# EAGLE design HuckyV2 (EAGLE 7.1.0)
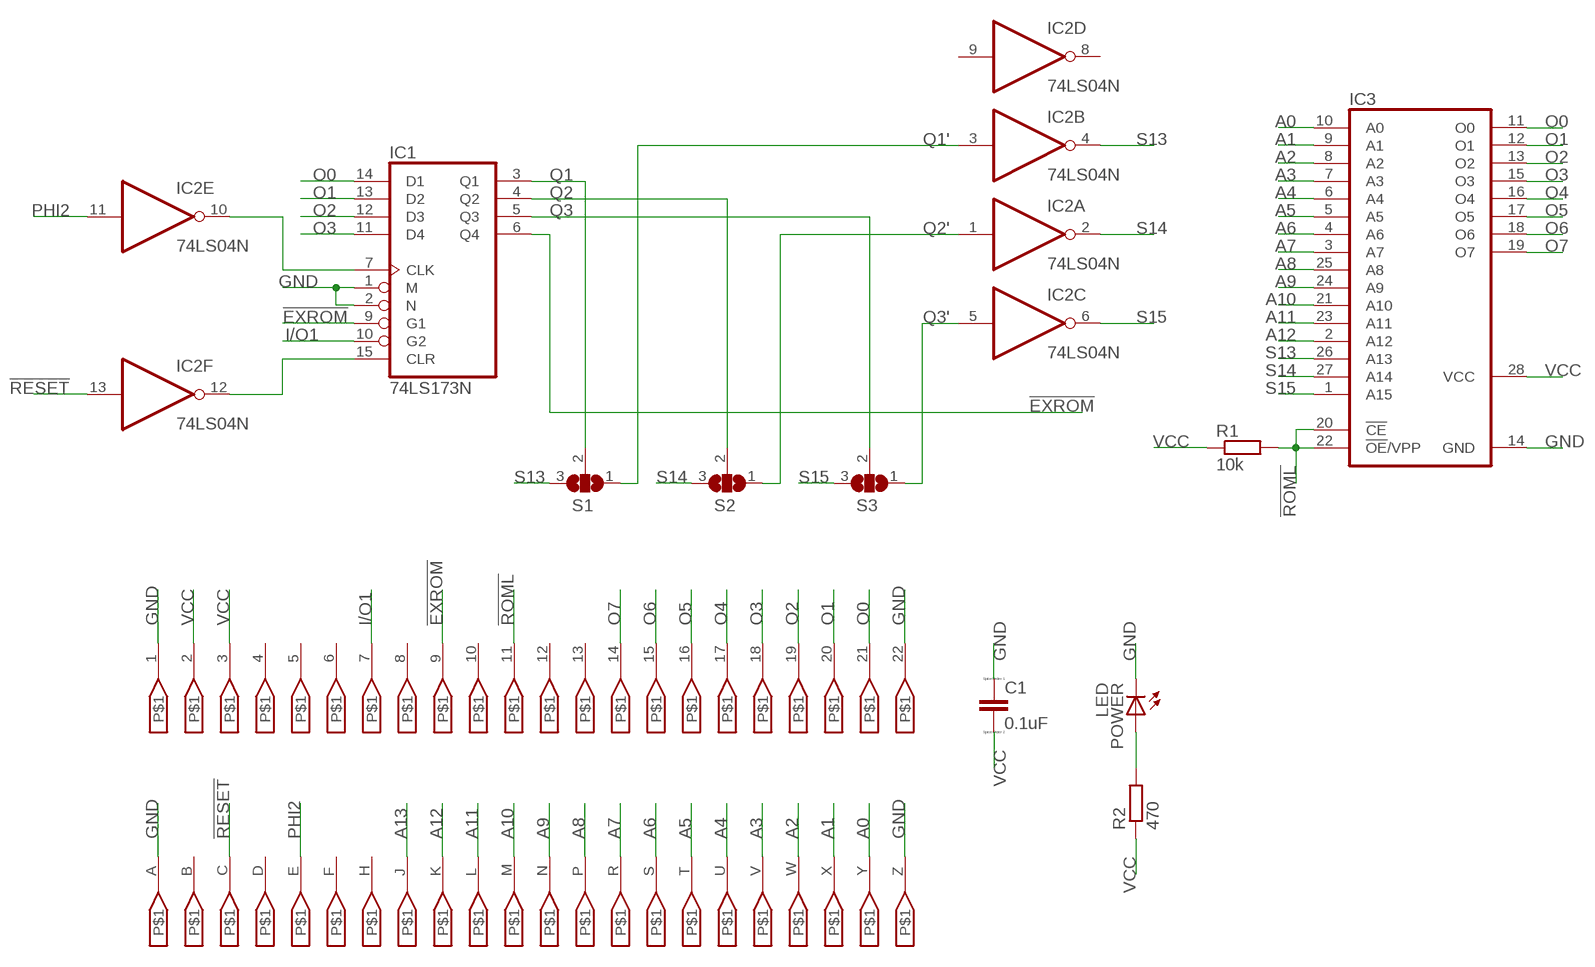
[diagram p0: schematic, sheet 1]

## Parts
C1  0.1uF  C-EU050-24X044_SP  [C050-24X044_SP]
IC1  74LS173N  [DIL16]
IC2  74LS04N  [DIL14]
IC3  27C512D  [DIL28-6]
POWER  LED  TLLG4400_SD  [LED3MM_SMALLER_DRILL]
R1  10k  R-EU_0207/10_SP  [0207/10_SP]
R2  470  R-EU_0207/10_SP  [0207/10_SP]
S1  SJ2W_NUMBERED  [SJ_2_NUM]
S2  SJ2W_NUMBERED  [SJ_2_NUM]
S3  SJ2W_NUMBERED  [SJ_2_NUM]
U$1  C64_EXPANSION_FINGERS_PIN8X1.9  [C64_EXPANSION_FINGERS_THINNER]

## Nets
!EXROM: IC1.6(Q4) IC1.9(G1) U$1.9
!RESET: IC2.13(F:I) U$1.C
!ROML: IC3.20(!CE) IC3.22(!OE!/VPP) R1.2 U$1.11
A0: IC3.10(A0) U$1.Y
A1: IC3.9(A1) U$1.X
A2: IC3.8(A2) U$1.W
A3: IC3.7(A3) U$1.V
A4: IC3.6(A4) U$1.U
A5: IC3.5(A5) U$1.T
A6: IC3.4(A6) U$1.S
A7: IC3.3(A7) U$1.R
A8: IC3.25(A8) U$1.P
A9: IC3.24(A9) U$1.N
A10: IC3.21(A10) U$1.M
A11: IC3.23(A11) U$1.L
A12: IC3.2(A12) U$1.K
A13: U$1.J
GND: C1.1 IC1.1(M) IC1.2(N) IC3.14(GND) POWER.K(C) U$1.1 U$1.22 U$1.A U$1.Z
I/O1: IC1.10(G2) U$1.7
N$1: IC1.7(CLK) IC2.10(E:O)
N$2: IC1.15(CLR) IC2.12(F:O)
N$3: POWER.A R2.2
O0: IC1.14(D1) IC3.11(O0) U$1.21
O1: IC1.13(D2) IC3.12(O1) U$1.20
O2: IC1.12(D3) IC3.13(O2) U$1.19
O3: IC1.11(D4) IC3.15(O3) U$1.18
O4: IC3.16(O4) U$1.17
O5: IC3.17(O5) U$1.16
O6: IC3.18(O6) U$1.15
O7: IC3.19(O7) U$1.14
PHI2: IC2.11(E:I) U$1.E
Q1: IC1.3(Q1) S1.2
Q1': IC2.3(B:I) S1.1
Q2: IC1.4(Q2) S2.2
Q2': IC2.1(A:I) S2.1
Q3: IC1.5(Q3) S3.2
Q3': IC2.5(C:I) S3.1
S13: IC2.4(B:O) IC3.26(A13) S1.3
S14: IC2.2(A:O) IC3.27(A14) S2.3
S15: IC2.6(C:O) IC3.1(A15) S3.3
VCC: C1.2 IC3.28(VCC) R1.1 R2.1 U$1.2 U$1.3
Unconnected: IC2.8(D:O) IC2.9(D:I) U$1.4 U$1.5 U$1.6 U$1.8 U$1.10 U$1.12 U$1.13 U$1.B U$1.D U$1.F U$1.H

## Power pins joined to a net without a drawn wire
GND: IC1.8(GND) IC2.7(P:GND)
VCC: IC1.16(VCC) IC2.14(P:VCC)

## Library data of the parts
C1 = MyCustomLibrary:C-EU: CAPACITOR, European symbol
IC1 = MyCustomLibrary:74*173: 4-bit D type REGISTER, 3-state
IC2 = MyCustomLibrary:74*04: Hex INVERTER
IC3 = MyCustomLibrary:27C512D: MEMORY; MPN: M27C512-10F1; OC_FARNELL: 1661676; OC_NEWARK: 56P9224
POWER = MyCustomLibrary:TLLG4400: Low Current (2mA) LED 3 mm Tinted Diffused Package color GREEN Source: Data sheet <http://www.farnell.com/datasheets/391098.pdf>
R1 R2 = MyCustomLibrary:R-EU_: RESISTOR, European symbol
S1-S3 = MyCustomLibrary:SJ2W: SMD solder JUMPER
U$1 = MyCustomLibrary:C64_EXPANSION_FINGERS_PIN

## Board
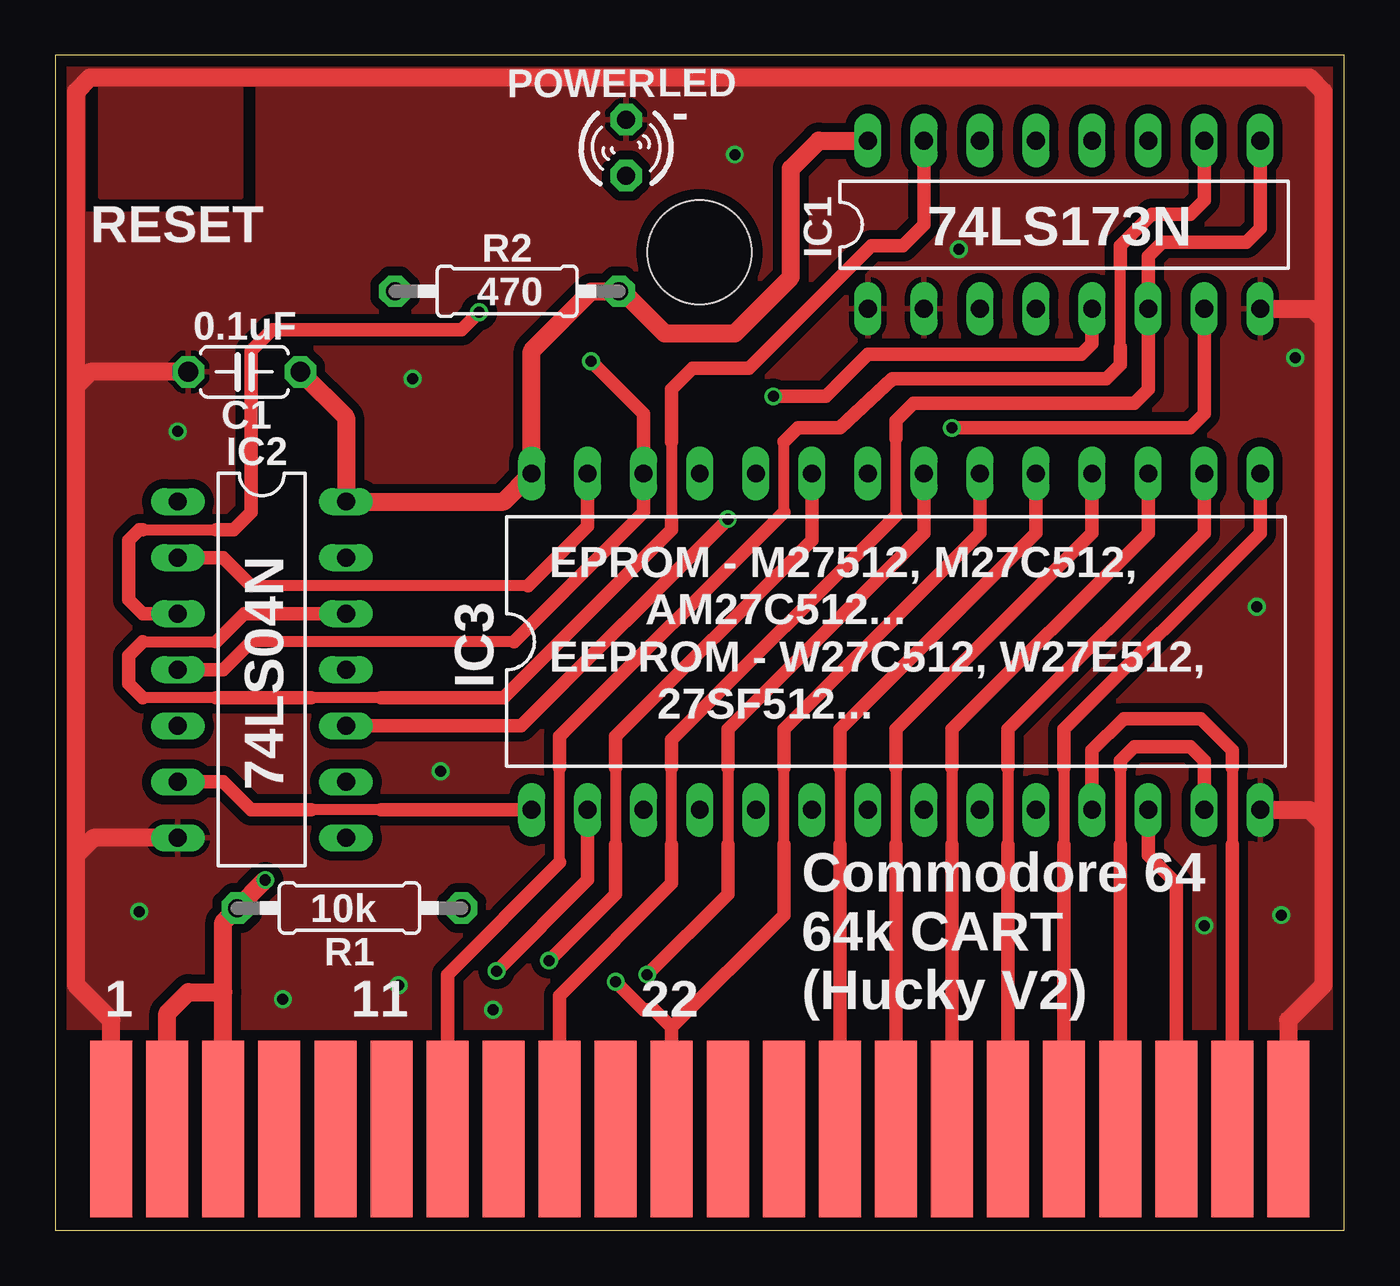
[diagram p1: board, top side]
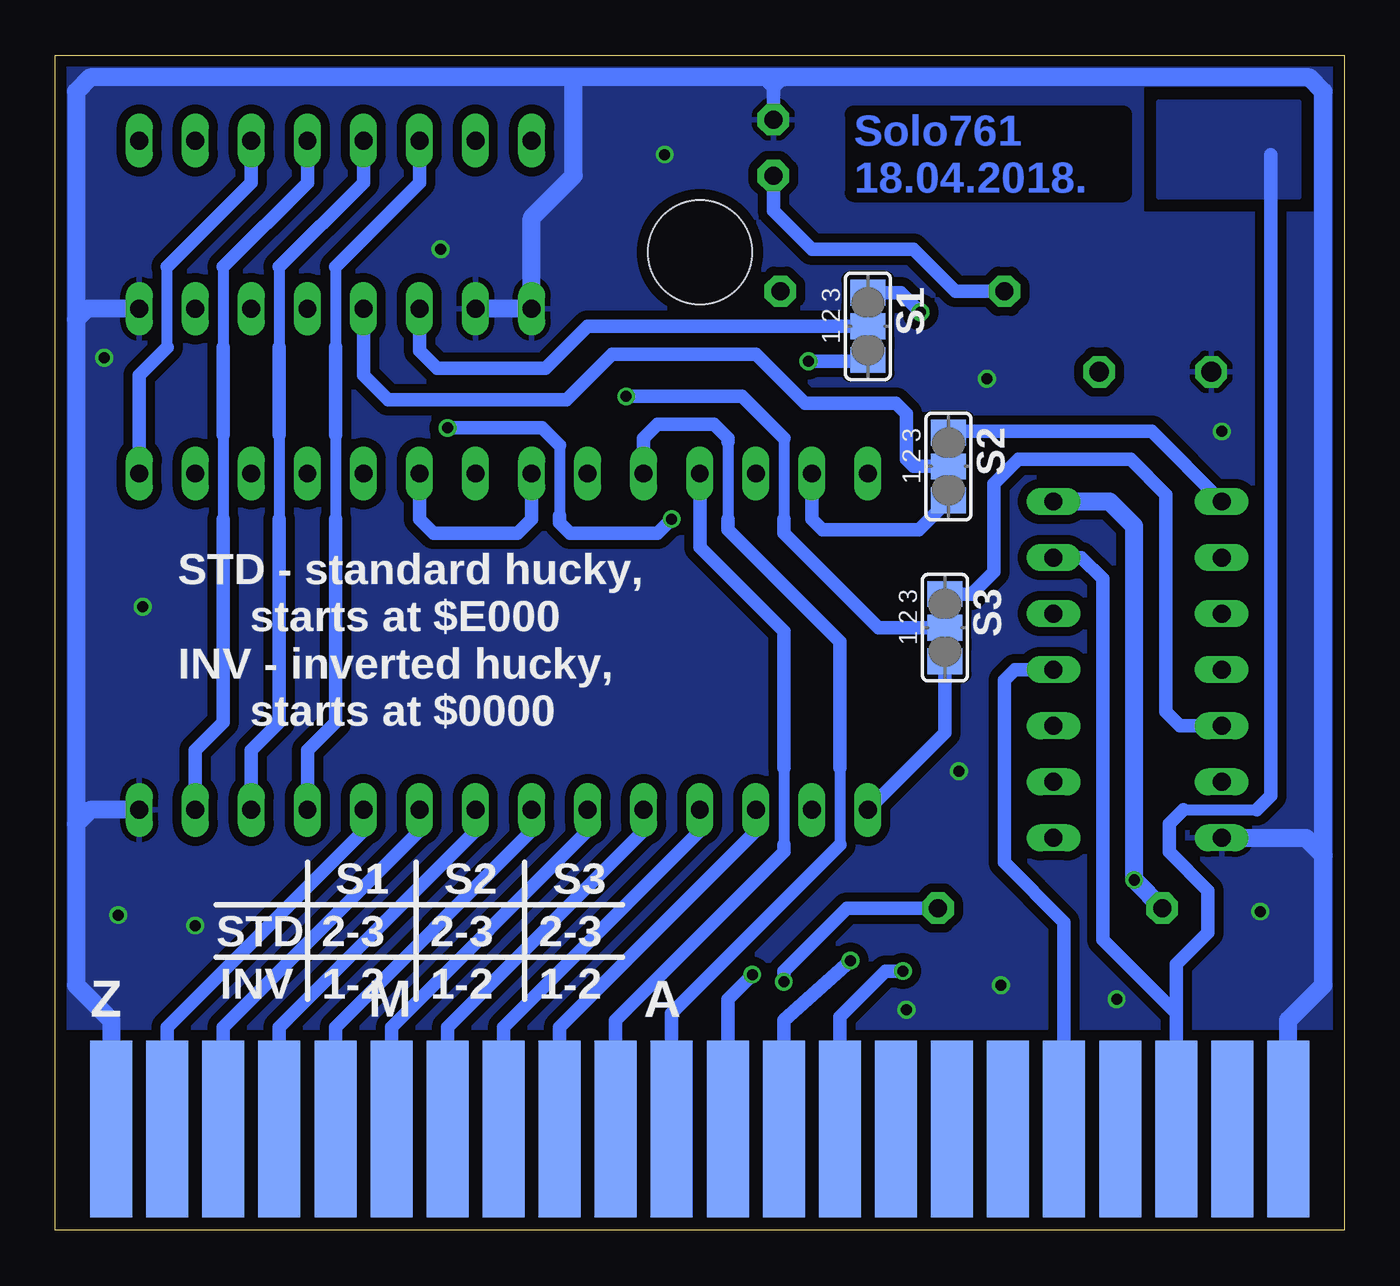
[diagram p2: board, bottom side, seen from below]

Size 58.42 x 53.24 mm. Coordinates in mm from the lower left corner, seen from the top.
Outline: 0,0 58.42,0 58.42,53.24 0,53.24 0,0
Copper layers (1*16): Top 0.035mm / dielectric 1.6mm / Bottom 0.035mm
Design rules "Custom_Elecrow_2-layer_PCB_eagle_rule": minimum track width 6mil, minimum drill 12mil, track to track 16mil, track to pad 16mil, pad to pad 12mil, via to via 12mil, smd to smd 0mil, copper to edge 20mil, drill to drill 10mil, minimum pad ring 6mil, minimum via ring 6mil, stop-mask expansion 0mil, vias tented up to drill 100mil, thermal gap 10mil
Holes 4.7 mm at 29.2,44.31

### Footprints (pad centres in the part's own frame; a part is rotated, then mirrored left to right if it is on the bottom)
C050-24X044_SP = drill 0.9 pad 1.422 octagon: 1 -2.54,0; 2 2.54,0
DIL16 = drill 0.813 long: 1 -8.89,-3.81; 2 -6.35,-3.81; 3 -3.81,-3.81; 4 -1.27,-3.81; 5 1.27,-3.81; 6 3.81,-3.81; 7 6.35,-3.81; 8 8.89,-3.81; 9 8.89,3.81; 10 6.35,3.81; 11 3.81,3.81; 12 1.27,3.81; 13 -1.27,3.81; 14 -3.81,3.81; 15 -6.35,3.81; 16 -8.89,3.81
DIL14 = drill 0.813 long: 1 -7.62,-3.81; 2 -5.08,-3.81; 3 -2.54,-3.81; 4 0,-3.81; 5 2.54,-3.81; 6 5.08,-3.81; 7 7.62,-3.81; 8 7.62,3.81; 9 5.08,3.81; 10 2.54,3.81; 11 0,3.81; 12 -2.54,3.81; 13 -5.08,3.81; 14 -7.62,3.81
DIL28-6 = drill 0.813 long: 1 -16.51,-7.62; 2 -13.97,-7.62; 3 -11.43,-7.62; 4 -8.89,-7.62; 5 -6.35,-7.62; 6 -3.81,-7.62; 7 -1.27,-7.62; 8 1.27,-7.62; 9 3.81,-7.62; 10 6.35,-7.62; 11 8.89,-7.62; 12 11.43,-7.62; 13 13.97,-7.62; 14 16.51,-7.62; 15 16.51,7.62; 16 13.97,7.62; 17 11.43,7.62; 18 8.89,7.62; 19 6.35,7.62; 20 3.81,7.62; 21 1.27,7.62; 22 -1.27,7.62; 23 -3.81,7.62; 24 -6.35,7.62; 25 -8.89,7.62; 26 -11.43,7.62; 27 -13.97,7.62; 28 -16.51,7.62
LED3MM_SMALLER_DRILL = drill 0.813 pad 1.422 octagon: A -1.27,0; K 1.27,0
0207/10_SP = drill 0.813 pad 1.422 octagon: 1 -5.08,0; 2 5.08,0
SJ_2_NUM = smd 1.168 x 1.6: 1 -1.524,0; 2 0,0; 3 1.524,0
C64_EXPANSION_FINGERS_THINNER = smd 1.9 x 8: 1 -25.4,0; 2 -22.86,0; 3 -20.32,0; 4 -17.78,0; 5 -15.24,0; 6 -12.7,0; 7 -10.16,0; 8 -7.62,0; 9 -5.08,0; 10 -2.54,0; 11 0,0; 12 2.54,0; 13 5.08,0; 14 7.62,0; 15 10.16,0; 16 12.7,0; 17 15.24,0; 18 17.78,0; 19 20.32,0; 20 22.86,0; 21 25.4,0; 22 27.94,0 | smd 1.9 x 8 bottom: A -25.4,0; B -22.86,0; C -20.32,0; D -17.78,0; E -15.24,0; F -12.7,0; H -10.16,0; J -7.62,0; K -5.08,0; L -2.54,0; M 0,0; N 2.54,0; P 5.08,0; R 7.62,0; S 10.16,0; T 12.7,0; U 15.24,0; V 17.78,0; W 20.32,0; X 22.86,0; Y 25.4,0; Z 27.94,0

### Placement (x,y rotation side)
C1  8.57,38.89 0 top
IC1  45.72,45.56 0 top
IC2  9.37,25.4 270 top
IC3  38.1,26.67 0 top
POWER  25.88,49.05 90 top
R1  13.34,14.61 0 top
R2  20.48,42.55 180 top
S1  21.59,40.96 270 bottom
S2  17.94,34.61 270 bottom
S3  18.1,27.3 270 bottom
U$1  27.94,4.6 0 top
U$2  [COMMODORE_SIGN]  18.1,43.97 0 top

### Tracks (layer width: path | path; a pad name or v marks a point on that pad's centre or on a via)
!EXROM
  Top 0.508: 27.94,17.46 27.94,20.95 | 38.1,32.38 38.1,35.88
  Top 0.61: U$1.9 22.86,10.64 27.94,15.72 27.94,17.46 | 38.1,32.38 27.94,22.23 27.94,20.95 | IC1.9 54.61,45.4 53.98,44.77 50.16,44.77 49.53,44.13 IC1.6 49.53,38.1 48.9,37.47 38.89,37.47 38.1,36.67 38.1,35.88
!RESET
  Bottom 0.508: 7.3,19.05 3.97,19.05
  Bottom 0.61: U$1.C 7.62,9.84 | 7.62,9.84 10.95,13.18 10.95,29.53 11.91,30.48 IC2.13 | 7.62,9.84 7.62,12.06 6.19,13.49 6.19,15.4 7.94,17.14 7.94,18.41 7.3,19.05 | 3.97,19.05 3.33,19.68 3.33,48.74
  pour Bottom: 2.06,51.12 8.41,51.12 8.41,46.83 2.06,46.83
!ROML  (via drill 0.5)
  Top 0.508: 33.02,17.46 33.02,20.95
  Top 0.61: U$1.11 27.94,9.21 | 27.94,9.21 33.02,14.29 33.02,17.46 | IC3.20 41.91,31.59 33.02,22.7 33.02,20.95 | 27.94,9.21 27.15,10 26.67,10 v25.4,11.27
  Bottom 0.61: IC3.22 36.83,32.23 37.47,31.59 41.27,31.59 41.91,32.23 IC3.20 | v25.4,11.27 25.4,11.75 22.54,14.61 R1.2
A0
  Bottom 0.61: IC3.10 44.45,18.1 53.34,9.21 U$1.Y
A1
  Bottom 0.61: IC3.9 41.91,18.1 50.8,9.21 U$1.X
A2
  Bottom 0.61: IC3.8 39.37,18.1 48.26,9.21 U$1.W
A3
  Bottom 0.61: IC3.7 36.83,18.1 45.72,9.21 U$1.V
A4
  Bottom 0.61: IC3.6 34.29,18.1 43.18,9.21 U$1.U
A5
  Bottom 0.61: IC3.5 31.75,18.1 40.64,9.21 U$1.T
A6
  Bottom 0.61: IC3.4 29.21,18.1 38.1,9.21 U$1.S
A7
  Bottom 0.61: IC3.3 26.67,18.1 35.56,9.21 U$1.R
A8
  Bottom 0.508: 25.4,20.95 25.4,17.46
  Bottom 0.61: IC3.25 29.21,30.96 25.4,27.15 25.4,20.95 | U$1.P 33.02,9.53 25.4,17.14 25.4,17.46
A9
  Bottom 0.508: 27.94,35.72 27.94,32.23 | 22.86,20.95 22.86,17.46
  Bottom 0.61: IC3.24 31.75,35.88 31.11,36.51 28.57,36.51 27.94,35.88 27.94,35.72 | 22.86,17.46 30.48,9.84 U$1.N | 27.94,32.23 27.94,31.75 22.86,26.67 22.86,20.95
A10  (via drill 0.5)
  Top 0.508: 30.48,22.7 30.48,22.54 | 30.48,20.95 30.48,17.46
  Top 0.61: IC3.21 39.37,31.59 30.48,22.7 | v26.83,11.59 30.48,15.24 30.48,17.46 | 30.48,22.54 30.48,21.11 30.48,20.95
  Bottom 0.61: v26.83,11.59 27.94,10.48 U$1.M
A11  (via drill 0.5)
  Top 0.508: 25.4,20.95 25.4,17.46
  Top 0.61: IC3.23 34.29,31.27 25.4,22.38 25.4,20.95 | v22.38,12.22 25.4,15.24 25.4,17.46
  Bottom 0.61: v22.38,12.22 25.4,9.53 U$1.L
A12  (via drill 0.5)
  Top 0.61: IC3.2 24.13,15.88 v20,11.75
  Bottom 0.61: v20,11.75 20.8,11.75 22.86,9.68 U$1.K
GND  (via drill 0.5)
  Top 0.813: U$1.A 2.54,9.53 0.95,11.11 0.95,16.99 | 0.95,16.99 0.95,38.26 | 0.95,38.26 0.95,51.59 1.59,52.23 56.83,52.23 57.47,51.59 57.47,41.27 | 57.47,41.27 57.47,18.41 | 57.47,18.41 57.47,11.11 55.88,9.53 U$1.Z | IC3.14 56.83,19.05 57.47,18.41 | IC1.8 56.99,41.75 57.47,41.27 | IC2.7 1.75,17.78 0.95,16.99 | C1.1 1.59,38.89 0.95,38.26
  Bottom 0.61: 25.88,51.75 25.4,52.23 | POWER.K 25.88,51.75 | 25.88,51.75 26.19,52.07
  Bottom 0.813: U$1.A 2.54,9.53 0.95,11.11 0.95,16.99 | 0.95,16.99 0.95,51.59 1.59,52.23 25.4,52.23 34.92,52.23 | 34.92,52.23 56.83,52.23 57.47,51.59 57.47,41.27 | 57.47,41.27 57.47,18.41 | 57.47,18.41 57.47,11.11 55.88,9.53 U$1.Z | IC3.14 56.83,19.05 57.47,18.41 | IC1.8 56.99,41.75 57.47,41.27 | IC2.7 1.75,17.78 0.95,16.99 | 34.92,52.23 34.92,47.78 36.83,45.88 IC1.1 IC1.2
  other vias: 5.56,36.2 16.19,38.58 3.81,14.45 10.32,10.48 15.56,11.11 19.84,10 30.8,48.74 56.2,39.53 40.96,44.45 54.45,28.26 55.56,14.29 52.07,13.81 17.46,20.8
  pour Top: 2.06,51.91 8.41,51.91 8.41,46.83 2.06,46.83
  pour Top: 0.32,52.86 1.27,52.86 1.27,46.04 9.21,46.04 9.21,51.91 1.43,51.91 1.43,52.86 58.1,52.86 58.1,9.21 0.32,9.21
  pour Bottom: 0.32,52.86 1.27,52.86 1.27,46.04 9.21,46.04 9.21,51.91 1.43,51.91 1.43,52.86 58.1,52.86 58.1,9.21 0.32,9.21
I/O1
  Top 0.508: 22.86,16.67 22.86,20.95 | 33.02,32.54 33.02,35.72 | 48.26,40.01 48.26,43.66
  Top 0.61: U$1.7 17.78,11.59 22.86,16.67 | 33.02,32.54 22.86,22.38 22.86,20.95 | 33.02,35.72 33.66,36.35 35.56,36.35 37.94,38.58 47.62,38.58 48.26,39.21 48.26,40.01 | IC1.10 52.07,46.67 51.44,46.04 49.69,46.04 48.26,44.61 48.26,43.66
N$1  (via drill 0.5)
  Top 0.61: IC1.7 52.07,36.99 51.44,36.35 v40.64,36.35 | IC2.10 21.11,22.86 v30.48,32.23
  Bottom 0.508: 35.56,35.56 35.56,32.38
  Bottom 0.61: v40.64,36.35 36.35,36.35 35.56,35.56 | v30.48,32.23 31.11,31.59 35.08,31.59 35.56,32.07 35.56,32.38
N$2
  Top 0.508: 27.94,35.72 27.94,32.23 | 14.76,24.13 11.59,24.13 | 7.3,24.13 3.97,24.13 | 3.97,26.67 7.3,26.67
  Top 0.61: IC1.15 39.37,45.56 38.42,44.61 36.99,44.61 31.43,39.05 28.89,39.05 27.94,38.1 27.94,35.72 | 3.97,24.13 3.33,24.77 3.33,26.04 3.97,26.67 | 7.3,26.67 8.57,27.94 IC2.12 | 27.94,32.23 27.94,31.75 20.32,24.13 14.76,24.13 | 7.3,24.13 11.59,24.13
N$3
  Bottom 0.61: R2.2 17.62,42.55 19.53,44.45 24.13,44.45 25.88,46.2 POWER.A
O0
  Top 0.508: 53.34,20.95 53.34,17.46 | 53.34,7.62 U$1.21
  Top 0.61: IC3.11 46.99,21.75 48.42,23.18 51.91,23.18 53.34,21.75 53.34,20.95 | 53.34,17.46 53.34,7.62
  Bottom 0.508: 45.72,43.66 45.72,40.01 | 45.72,36.04 45.72,32.23
  Bottom 0.61: IC1.14 41.91,47.47 45.72,43.66 | IC3.11 46.99,21.75 45.72,23.02 45.72,32.23 | 45.72,40.01 45.72,36.04
O1
  Top 0.61: IC3.12 49.53,16.99 50.8,15.72 U$1.20
  Bottom 0.508: 48.26,43.66 48.26,40.01 | 48.26,36.04 48.26,32.23
  Bottom 0.61: IC1.13 44.45,47.47 48.26,43.66 | IC3.12 49.53,21.75 48.26,23.02 48.26,32.23 | 48.26,40.01 48.26,36.04
O2
  Top 0.508: 48.26,20.95 48.26,17.46 | 48.26,6.83 U$1.19
  Top 0.61: IC3.13 52.07,21.27 51.44,21.91 48.9,21.91 48.26,21.27 48.26,20.95 | 48.26,17.46 48.26,6.83
  Bottom 0.508: 50.8,43.66 50.8,40.01 | 50.8,36.04 50.8,32.23
  Bottom 0.61: IC1.12 46.99,47.47 50.8,43.66 | IC3.13 52.07,21.75 50.8,23.02 50.8,32.23 | 50.8,40.01 50.8,36.04
O3
  Top 0.508: 45.72,20.95 45.72,17.46 | 45.72,6.99 U$1.18
  Top 0.61: IC3.15 54.61,31.59 45.72,22.7 45.72,21.11 45.72,20.95 | 45.72,17.46 45.72,6.99
  Bottom 0.508: 53.34,40.01 53.34,43.66
  Bottom 0.61: IC3.15 54.61,38.73 53.34,40.01 | 53.34,43.66 49.53,47.47 IC1.11
O4
  Top 0.508: 43.18,20.95 43.18,17.46 | 43.18,7.46 U$1.17
  Top 0.61: IC3.16 52.07,31.59 43.18,22.7 43.18,20.95 | 43.18,17.46 43.18,7.46
O5
  Top 0.508: 40.64,20.95 40.64,17.46 | 40.64,7.46 U$1.16
  Top 0.61: IC3.17 49.53,31.59 40.64,22.7 40.64,20.95 | 40.64,17.46 40.64,7.46
O6
  Top 0.508: 38.1,20.95 38.1,17.46 | 38.1,7.62 U$1.15
  Top 0.61: IC3.18 46.99,31.59 38.1,22.7 38.1,20.95 | 38.1,17.46 38.1,7.62
O7
  Top 0.508: 35.56,20.95 35.56,17.46 | 35.56,7.46 U$1.14
  Top 0.61: IC3.19 44.45,31.59 35.56,22.7 35.56,20.95 | 35.56,17.46 35.56,7.46
PHI2
  Bottom 0.61: U$1.E 12.7,13.97 15.4,16.67 15.4,24.92 14.92,25.4 IC2.11
Q1
  Bottom 0.61: IC1.3 41.91,39.85 41.12,39.05 36.2,39.05 34.29,40.96 S1.2
Q1'  (via drill 0.5)
  Top 0.508: 3.97,31.75 7.3,31.75
  Top 0.61: IC2.3 3.97,27.94 3.33,28.57 3.33,31.27 3.81,31.75 3.97,31.75 | v19.21,41.59 18.41,40.8 9.84,40.8 8.89,39.85 8.89,32.54 8.1,31.75 7.3,31.75
  Bottom 0.61: v19.21,41.59 20.1,42.48 S1.1
Q2
  Bottom 0.61: IC1.4 44.45,38.73 43.34,37.62 35.24,37.62 33.18,39.69 26.67,39.69 24.45,37.47 20.32,37.47 19.84,36.99 19.84,34.92 19.53,34.61 S2.2
Q2'
  Bottom 0.61: IC2.1 8.73,36.2 17.88,36.2 S2.1
Q3  (via drill 0.5)
  Top 0.61: IC1.5 46.99,40.16 46.51,39.69 36.83,39.69 34.92,37.78 v32.54,37.78
  Bottom 0.508: 25.4,35.88 25.4,32.23
  Bottom 0.61: v32.54,37.78 27.3,37.78 25.4,35.88 | S3.2 21.11,27.3 25.4,31.59 25.4,32.23
Q3'
  Bottom 0.61: IC2.5 7.46,22.86 8.1,23.5 8.1,33.34 9.68,34.92 14.76,34.92 15.88,33.81 15.88,29.84 16.89,28.83 S3.1
S13  (via drill 0.5)
  Top 0.508: 20.8,26.67 8.89,26.67
  Top 0.61: 8.89,26.67 7.62,25.4 IC2.4 | 20.8,26.67 26.67,32.54 IC3.26 26.67,36.99 v24.29,39.37
  Bottom 0.61: v24.29,39.37 21.97,39.37 S1.3
S14
  Top 0.508: 21.43,29.21 8.89,29.21
  Top 0.61: IC3.27 24.13,31.91 21.43,29.21 | 8.89,29.21 7.62,30.48 IC2.2
  Bottom 0.61: IC3.27 24.13,32.23 23.65,31.75 19.27,31.75 S2.3
S15
  Top 0.508: 14.76,19.05 11.59,19.05
  Top 0.61: IC2.6 7.62,20.32 8.89,19.05 11.59,19.05 | IC3.1 14.76,19.05
  Bottom 0.61: IC3.1 18.1,22.54 S3.3
VCC  (via drill 0.5)
  Top 0.813: U$1.3 7.62,10.79 | 7.62,10.79 7.62,13.97 R1.1 v9.53,15.88 | C1.2 13.18,36.83 IC2.14 20.32,33.02 IC3.28 21.59,39.85 24.29,42.55 R2.1 25.72,42.55 27.62,40.64 30.8,40.64 33.34,43.18 33.34,48.1 34.61,49.37 IC1.16 | U$1.2 5.08,9.84 6.03,10.79 7.62,10.79
  Bottom 0.813: IC2.14 10.64,33.02 9.53,31.91 v9.53,15.88 R1.1

### Text on the board
Bottom: Solo761 / 18.04.2018.
tNames: - | RESET | EPROM - M27512, M27C512, / AM27C512... / EEPROM - W27C512, W27E512, / 27SF512... | 1 11 22 | Commodore 64 / 64k CART / (Hucky V2)
bNames: STD - standard hucky, / starts at $E000 / INV - inverted hucky, / starts at $0000 | S3 | S2 | S1 | 2-3 | 2-3 | 2-3 | STD | 1-2 | 1-2 | 1-2 | INV | Z M A
bStop: Solo761 / 18.04.2018.